# Altium project REFLOW_CONTROLLER_A01.PrjPcb
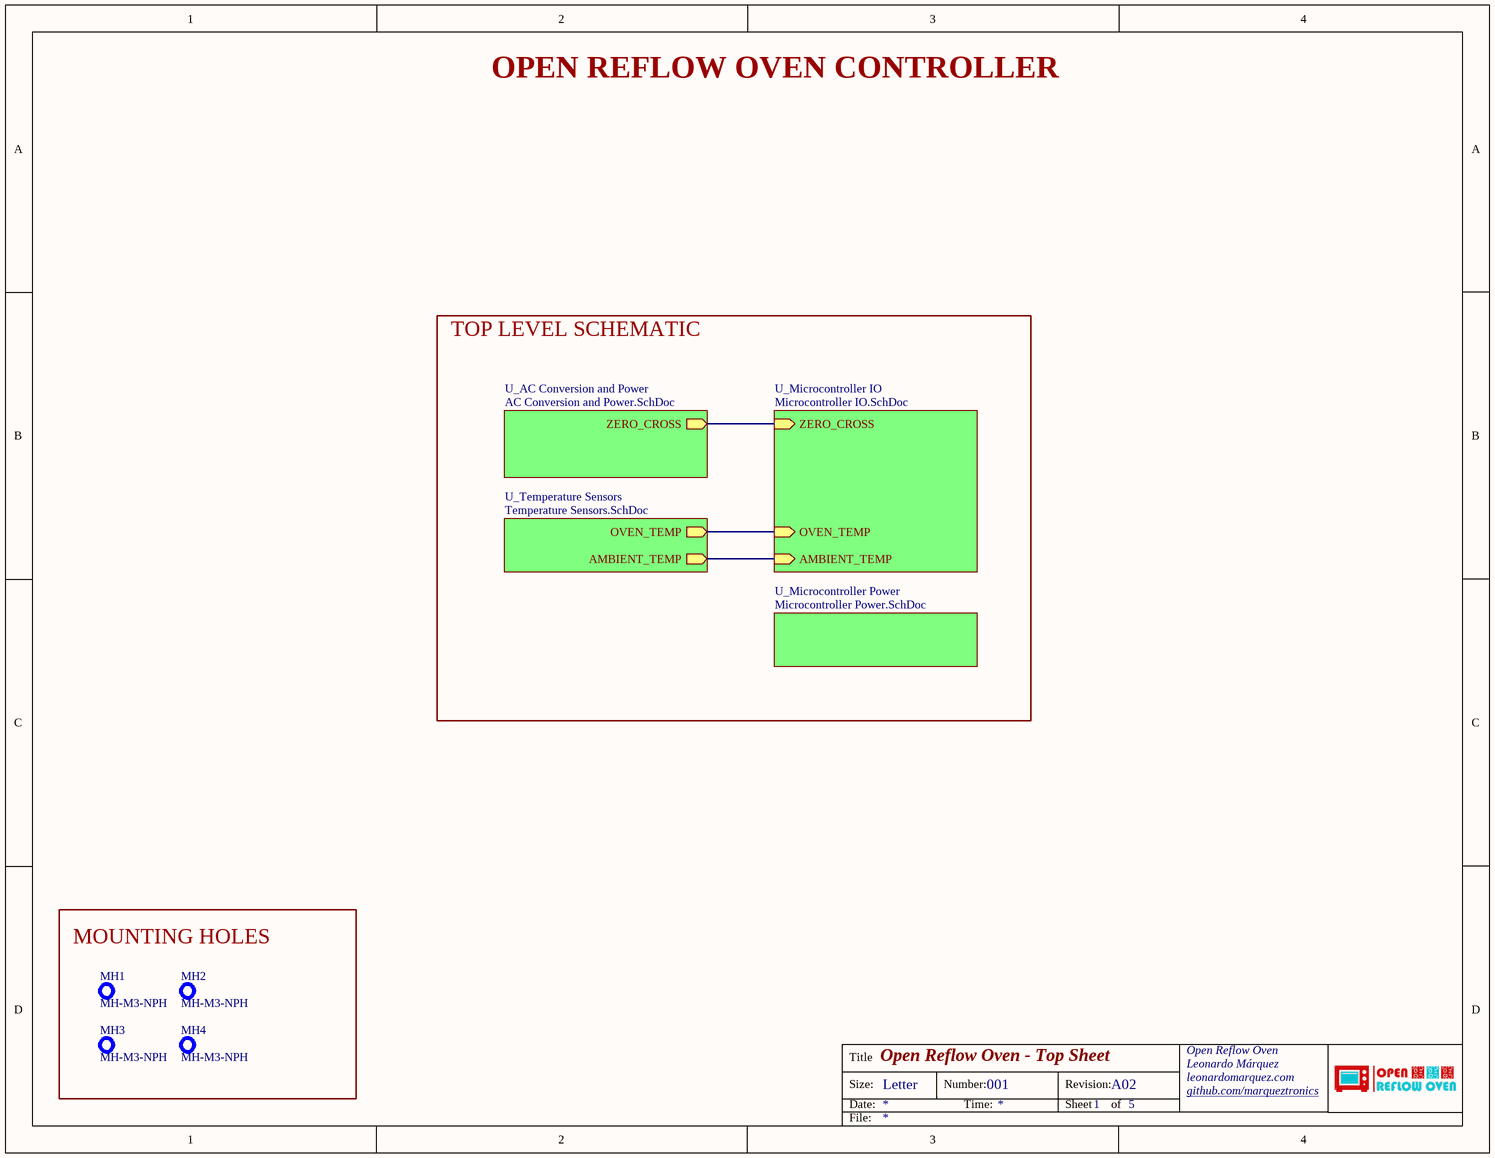
[diagram p0: Main.SchDoc]
Address1: Leonardo Márquez
5 sheets, 103 parts. Net scope: hierarchical (ports join the sheet entries above them; power ports are global).
Sheets:
  Main.SchDoc
    U_AC Conversion and Power = AC Conversion and Power.SchDoc
    U_Microcontroller IO = Microcontroller IO.SchDoc
    U_Microcontroller Power = Microcontroller Power.SchDoc
    U_Temperature Sensors = Temperature Sensors.SchDoc

## Sheet Main.SchDoc: Open Reflow Oven - Top Sheet
size Letter; DrawnBy: Leonardo Márquez; Organization: Open Reflow Oven; Address1: leonardomarquez.com; Address2: github.com/marqueztronics; DocumentNumber: 001; Revision: A02; SheetNumber: 1; SheetTotal: 5

### Parts
MH1  MH-M3-NPH  [MH-M3-NPH]  (no BOM)
MH2  MH-M3-NPH  [MH-M3-NPH]  (no BOM)
MH3  MH-M3-NPH  [MH-M3-NPH]  (no BOM)
MH4  MH-M3-NPH  [MH-M3-NPH]  (no BOM)

### Blocks framed on the sheet
MOUNTING HOLES: MH1-MH4

### Sub-sheets
U_AC Conversion and Power = AC Conversion and Power.SchDoc: ZERO_CROSS (out)
U_Microcontroller IO = Microcontroller IO.SchDoc: ZERO_CROSS (in), OVEN_TEMP (in), AMBIENT_TEMP (in)
U_Microcontroller Power = Microcontroller Power.SchDoc: no entries
U_Temperature Sensors = Temperature Sensors.SchDoc: OVEN_TEMP (out), AMBIENT_TEMP (out)

### Nets
AMBIENT_TEMP: sheet U_Microcontroller IO/AMBIENT_TEMP, sheet U_Temperature Sensors/AMBIENT_TEMP
OVEN_TEMP: sheet U_Microcontroller IO/OVEN_TEMP, sheet U_Temperature Sensors/OVEN_TEMP
ZERO_CROSS: sheet U_AC Conversion and Power/ZERO_CROSS, sheet U_Microcontroller IO/ZERO_CROSS

### Notes on the sheet
- OPEN REFLOW OVEN CONTROLLER
- TOP LEVEL SCHEMATIC
- Title
- Size:
- Date:
- Letter
- Number:
- Time:
- Revision:
- Sheet
- of
- File:

### Library data of the parts
MH1-MH4 = MH-M3-NPH: Mounting Hole M3 Non Plated Hole; Manufacturer: *; Manufacturer Part Number: *; Price Unit: *; Price 1K: *; Supplier 1: *; Supplier Part Number 1: *

## Sheet AC Conversion and Power.SchDoc: AC Conversion and Power
size Letter; DrawnBy: Leonardo Marquez; Organization: Open Reflow Oven; Address1: leonardomarquez.com; Address2: github.com/marqueztronics; DocumentNumber: 001; Revision: A02; SheetNumber: 2; SheetTotal: 5
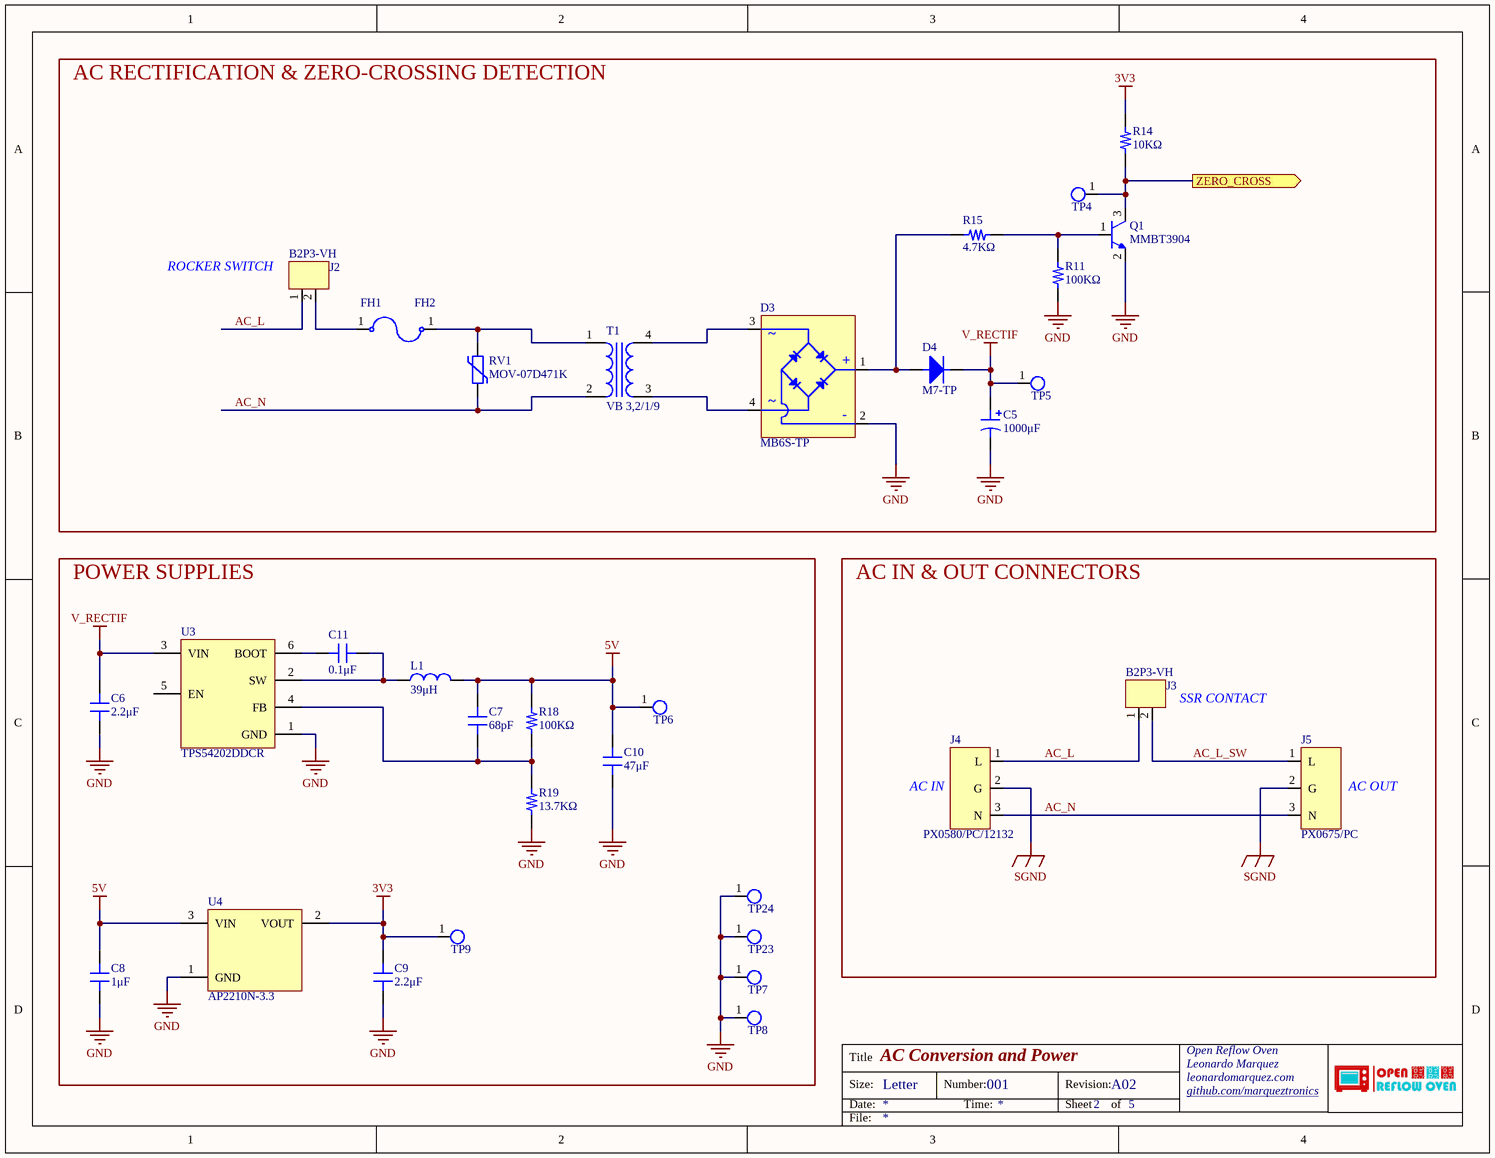
[diagram p1: AC Conversion and Power.SchDoc]

### Parts
C5  1000μF  [CPOL10X20]
C6  2.2μF  [C0805]
C7  68pF  [C0603]
C8  1μF  [C0603]
C9  2.2μF  [C0805]
C10  47μF  [C1210]
C11  0.1μF  [C0603]
D3  MB6S-TP  [MBS-1]
D4  M7-TP  [DO-214AC]
FH1  01000020Z  [100-020]  (value not drawn)
FH2  01000020Z  [100-020]  (value not drawn)
J2  B2P3-VH  [B2P3-VH]
J3  B2P3-VH  [B2P3-VH]
J4  PX0580/PC/12132  [PX0580/PC/12132]
J5  PX0675/PC  [PX0675/PC]
L1  39μH  [L_ASPI-0602S]
Q1  MMBT3904  [SOT-23]
R11  100KΩ  [R0603]
R14  10KΩ  [R0603]
R15  4.7KΩ  [R0603]
R18  100KΩ  [R0603]
R19  13.7KΩ  [R0603]
RV1  MOV-07D471K  [MOV-07D471K]
T1  VB 3,2/1/9  [VB_3,2/1/9]
TP4  TP-1MM-ROUND  [TP-1MM-ROUND]  (value not drawn)  (no BOM)
TP5  TP-1MM-ROUND  [TP-1MM-ROUND]  (value not drawn)  (no BOM)
TP6  TP-1MM-ROUND  [TP-1MM-ROUND]  (value not drawn)  (no BOM)
TP7  TP-1MM-ROUND  [TP-1MM-ROUND]  (value not drawn)  (no BOM)
TP8  TP-1MM-ROUND  [TP-1MM-ROUND]  (value not drawn)  (no BOM)
TP9  TP-1MM-ROUND  [TP-1MM-ROUND]  (value not drawn)  (no BOM)
TP23  TP-1MM-ROUND  [TP-1MM-ROUND]  (value not drawn)  (no BOM)
TP24  TP-1MM-ROUND  [TP-1MM-ROUND]  (value not drawn)  (no BOM)
U3  TPS54202DDCR  [SOT-23-6]
U4  AP2210N-3.3  [SOT-23]

### Blocks framed on the sheet
AC RECTIFICATION & ZERO-CROSSING DETECTION: C5 D3 D4 FH1 FH2 J2 Q1 R11 R14 R15 RV1 T1 TP4 TP5
POWER SUPPLIES: C6-C11 L1 R18 R19 TP6-TP9 TP23 TP24 U3 U4
AC IN & OUT CONNECTORS: J3-J5

### Ports
ZERO_CROSS (out)

### Nets
3V3: C9.2 R14.2 TP9.1 U4.2(VOUT)
5V: C7.2 C8.2 C10.2 L1.2 R18.2 TP6.1 U4.3(VIN)
GND: C5.2 C6.1 C8.1 C9.1 C10.1 D3.2(-) Q1.2(E) R11.1 R19.1 TP7.1 TP8.1 TP23.1 TP24.1 U3.1(GND) U4.1(GND)
SGND: J4.2(G) J5.2(G)
V_RECTIF: C5.1 C6.2 D4.K TP5.1 U3.3(VIN)
AC_L: J2.1 J3.1 J4.1(L)
AC_L_SW: J3.2 J5.1(L)
AC_N: J4.3(N) J5.3(N) RV1.1 T1.2
ZERO_CROSS: Q1.3(C) R14.1 TP4.1 ; port ZERO_CROSS
NetC7_1: C7.1 R18.1 R19.2 U3.4(FB)
NetC11_1: C11.1 L1.1 U3.2(SW)
NetC11_2: C11.2 U3.6(BOOT)
NetD3_1: D3.1(+) D4.A R15.1
NetD3_3: D3.3 T1.4
NetD3_4: D3.4 T1.3
NetFH1_1: FH1.1 J2.2
NetFH2_1: FH2.1 RV1.2 T1.1
NetQ1_1: Q1.1(B) R11.2 R15.2

Not connected (* = marked no-connect by the designer): U3 5(EN)

### Notes on the sheet
- (near J2) ROCKER SWITCH
- (near J3) SSR CONTACT
- (near J4) AC IN
- (near J5) AC OUT
- Title
- Size:
- Date:
- Letter
- Number:
- Time:
- Revision:
- Sheet
- of
- File:

### Library data of the parts
C5 = C-1000UF-16V-CPOL10X20: 1000uF 16V 78mΩ@100kHz ±20% 1.05A@100kHz Plugin,D10xL20mm Aluminum Electrolytic Capacitors - Leaded ROHS; Manufacturer: Rubycon; Manufacturer Part Number: 16YXF1000MEFC10X20; Price Unit: 0.1397; Price 1K: 0.0774; Supplier 1: LCSC; Supplier Part Number 1: C110138
C6 C9 = C-2.2UF-35V-X7R-C0805: 35V 2.2uF X7R ±10% 0805 Multilayer Ceramic Capacitors MLCC - SMD/SMT ROHS; Manufacturer: TDK; Manufacturer Part Number: CGA4J1X7R1V225KT0Y0E; Price Unit: 0.1161; Price 1K: 0.0724; Supplier 1: LCSC; Supplier Part Number 1: C342739
C7 = C-68PF-50V-NP0-C0603: 50V 68pF NP0 ±5% 0603 Multilayer Ceramic Capacitors MLCC - SMD/SMT ROHS; Manufacturer: Yageo; Manufacturer Part Number: CC0603JRNPO9BN680; Price Unit: 0.0027; Price 1K: 0.0021; Supplier 1: LCSC; Supplier Part Number 1: C62782
C8 = C-1UF-16V-X7R-C0603: 16V 1uF X7R ±10% 0603 Multilayer Ceramic Capacitors MLCC - SMD/SMT ROHS; Manufacturer: Samsung Electro-Mechanics; Manufacturer Part Number: CL10B105KO8NNNC; Price Unit: 0.0033; Price 1K: 0.0029; Supplier 1: LCSC; Supplier Part Number 1: C59782
C10 = C-47UF-16V-X5R-C1210: 16V 47uF X5R ±10% 1210 Multilayer Ceramic Capacitors MLCC - SMD/SMT ROHS; Manufacturer: Murata; Manufacturer Part Number: GRM32ER61C476KE15L; Price Unit: 0.1302; Price 1K: 0.079; Supplier 1: LCSC; Supplier Part Number 1: C77101
C11 = C-0.1UF-50V-X7R-C0603: 50V 100nF X7R ±10% 0603 Multilayer Ceramic Capacitors MLCC - SMD/SMT ROHS; Manufacturer: Samsung Electro-Mechanics; Manufacturer Part Number: CL10B104KB8NNNC; Price Unit: 0.0024; Price 1K: 0.0019; Supplier 1: LCSC; Supplier Part Number 1: C1591
D3 = D-BRIDGE-RECTIFIER-600V-0.5A-MBS-1: 35A 1V@400mA 800mA 600V MBS Bridge Rectifiers ROHS; Manufacturer: Micro Commercial Components; Manufacturer Part Number: MB6S-TP; Price Unit: 0.0398; Price 1K: 0.0284; Supplier 1: LCSC; Supplier Part Number 1: C85619
D4 = D-1KV-1A-DO-214AC: 1A 1kV 1.1V@1A SMA(DO-214AC) Diodes - General Purpose ROHS; Manufacturer: Micro Commercial Components; Manufacturer Part Number: M7-TP; Price Unit: 0.013; Price 1K: 0.0104; Supplier 1: LCSC; Supplier Part Number 1: C85148
FH1 FH2 = FH-1P-5X20MM-100-020: Circuit Board Mount Fuse Clips for 5mm Diameter Fuses; Manufacturer: Littelfuse; Manufacturer Part Number: 01000020Z; Price Unit: 0.206; Price 1K: 0.1324; Supplier 1: LCSC; Supplier Part Number 1: C142797
J2 J3 = J-2P-7.92MM-B2P3-VH: 1x2P 2P VH 1 7.92mm 2 Brass Plugin,P=7.92mm Wire To Board Connector ROHS; Manufacturer: JST; Manufacturer Part Number: B2P3-VH(LF)(SN); Price Unit: 0.0558; Price 1K: 0.0310; Supplier 1: LCSC; Supplier Part Number 1: C160745
J4 = J-3P-IEC-C14-PX0580/PC/12132: C14 Right Angle Panel Mount, PCB Mount IEC Connector Male, 10A, 250 V; Manufacturer: Bulgin; Manufacturer Part Number: PX0580/PC/12132; Price Unit: 5.03; Price 1K: 4.37; Supplier 1: RS; Supplier Part Number 1: 261-5840
J5 = J-3P-IEC-C14-PX0675/PC: C13 Right Angle Panel Mount, PCB Mount IEC Connector Socket, 10A, 250 V; Manufacturer: Bulgin; Manufacturer Part Number: PX0675/PC; Price Unit: 6.49; Price 1K: 5.45; Supplier 1: RS; Supplier Part Number 1: 801-948
L1 = L-39UH-860MA-L_ASPI-0602S: 860mA 39uH ±20% SMD,6.7x6.7mm Power Inductors ROHS; Manufacturer: Abracon; Manufacturer Part Number: ASPI-0602S-390M-T; Price Unit: 0.0798; Price 1K: 0.0437; Supplier 1: LCSC; Supplier Part Number 1: C187310
Q1 = Q-NPN-40V-0.2A-SOT-23: 40V 250mW 200mA NPN SOT-23 Bipolar Transistors - BJT ROHS; Manufacturer: Nexperia; Manufacturer Part Number: MMBT3904; Price Unit: 0.0155; Price 1K: 0.0124; Supplier 1: LCSC; Supplier Part Number 1: C108429
R11 R18 = R-100K-1/10W-R0603: 100mW Thick Film Resistors 75V ±100ppm/℃ ±1% 100kΩ 0603 Chip Resistor - Surface Mount ROHS; Manufacturer: Yageo; Manufacturer Part Number: RC0603FR-07100KL; Price Unit: 0.0009; Price 1K: 0.0007; Supplier 1: LCSC; Supplier Part Number 1: C14675
R14 = R-10K-1/10W-R0603: 100mW Thick Film Resistors 75V ±100ppm/℃ ±1% 10kΩ 0603 Chip Resistor - Surface Mount ROHS; Manufacturer: Yageo; Manufacturer Part Number: RC0603FR-0710KL; Price Unit: 0.0009; Price 1K: 0.0007; Supplier 1: LCSC; Supplier Part Number 1: C98220
R15 = R-4.7K-1/10W-R0603: 100mW Thick Film Resistors 75V ±100ppm/℃ ±1% 4.7kΩ 0603 Chip Resistor - Surface Mount ROHS; Manufacturer: Yageo; Manufacturer Part Number: RC0603FR-074K7L; Price Unit: 0.001; Price 1K: 0.0008; Supplier 1: LCSC; Supplier Part Number 1: C99782
R19 = R-13.7K-1/10W-R0603: 100mW Thick Film Resistors 75V ±100ppm/℃ ±1% 13.7kΩ 0603 Chip Resistor - Surface Mount ROHS; Manufacturer: Yageo; Manufacturer Part Number: RC0603FR-0713K7L; Price Unit: 0.0013; Price 1K: 0.001; Supplier 1: LCSC; Supplier Part Number 1: C482771
RV1 = RV-470V-1.2KA-MOV-07D471K: VARISTOR 470V 1.2KA DISC 7MM; Manufacturer: Bourns; Manufacturer Part Number: MOV-07D471K; Price Unit: 0.0857; Price 1K: 0.0532; Supplier 1: LCSC; Supplier Part Number 1: C1527385
T1 = T-230V-9V-VB_3,2/1/9: Block 9V ac 1 Output Through Hole PCB Transformer, 3.2VA; Manufacturer: Block; Manufacturer Part Number: VB 3,2/1/9; Price Unit: 7.24; Price 1K: 7.24; Supplier 1: RS; Supplier Part Number 1: 732-0398
TP4-TP9 TP23 TP24 = TP-1MM-ROUND: Round Test Point 1mm Dia
U3 = U-TPS54202DDCR-SOT-23-6: 4.5-V to 28-V Input, 2-A Output, EMI Friendly  Synchronous Step Down Converter; Manufacturer: Texas Instruments; Manufacturer Part Number: TPS54202DDCR; Price Unit: 0.1566; Price 1K: 0.0922; Supplier 1: LCSC; Supplier Part Number 1: C191884
U4 = U-AP2210N-3.3TRG1-SOT-23: 300mA 75dB@(100Hz) Fixed 3.3V Positive electrode 13.2V SOT-23 Linear Voltage Regulators (LDO) ROHS; Manufacturer: Diodes Incorporated; Manufacturer Part Number: AP2210N-3.3TRG1; Price Unit: 0.0907; Price 1K: 0.0597; Supplier 1: LCSC; Supplier Part Number 1: C155508

## Sheet Microcontroller IO.SchDoc: Microcontroller IO
size Letter; DrawnBy: Leonardo Marquez; Organization: Open Reflow Oven; Address1: leonardomarquez.com; Address2: github.com/marqueztronics; DocumentNumber: 001; Revision: A02; SheetNumber: 3; SheetTotal: 5
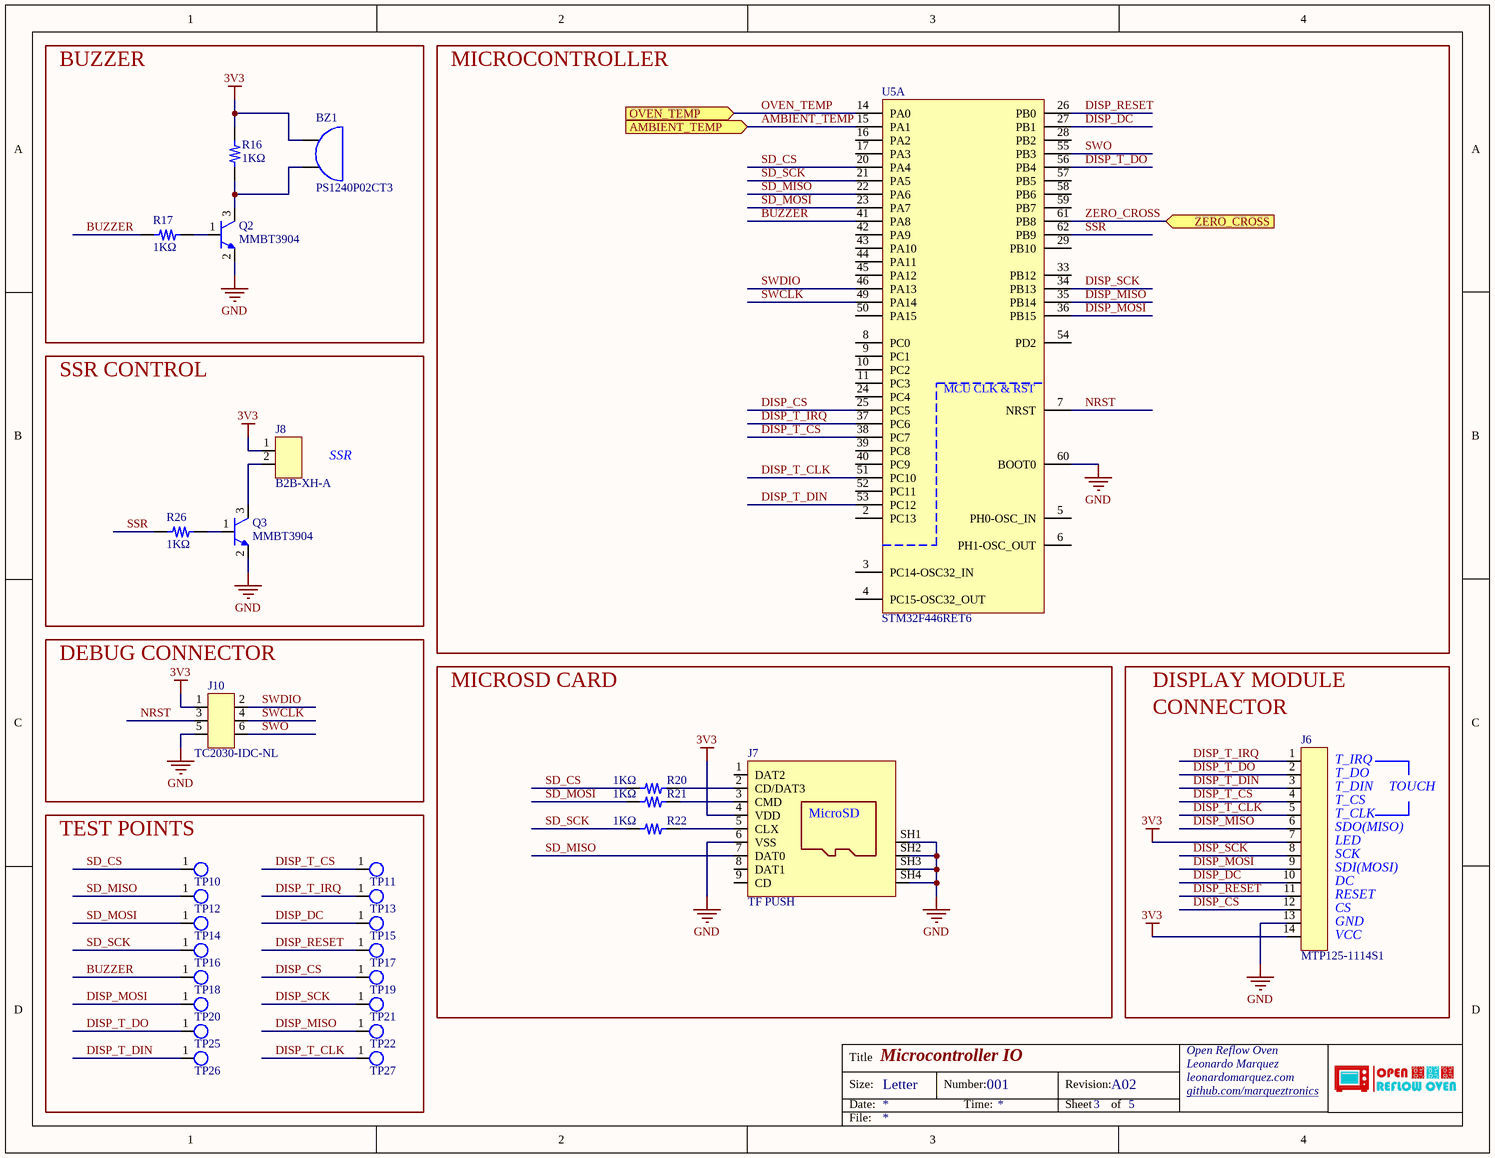
[diagram p2: Microcontroller IO.SchDoc]

### Parts
BZ1  PS1240P02CT3  [PS1240P02CT3]
J6  MTP125-1114S1  [MTP125-1114S1]
J7  TF PUSH  [TF_PUSH]
J8  B2B-XH-A  [B2B-XH-A]
J10  TC2030-IDC-NL  [TC2030-IDC-NL-FP]  (no BOM)
Q2  MMBT3904  [SOT-23]
Q3  MMBT3904  [SOT-23]
R16  1KΩ  [R0603]
R17  1KΩ  [R0603]
R20  1KΩ  [R0603]
R21  1KΩ  [R0603]
R22  1KΩ  [R0603]
R26  1KΩ  [R0603]
TP10  TP-1MM-ROUND  [TP-1MM-ROUND]  (value not drawn)  (no BOM)
TP11  TP-1MM-ROUND  [TP-1MM-ROUND]  (value not drawn)  (no BOM)
TP12  TP-1MM-ROUND  [TP-1MM-ROUND]  (value not drawn)  (no BOM)
TP13  TP-1MM-ROUND  [TP-1MM-ROUND]  (value not drawn)  (no BOM)
TP14  TP-1MM-ROUND  [TP-1MM-ROUND]  (value not drawn)  (no BOM)
TP15  TP-1MM-ROUND  [TP-1MM-ROUND]  (value not drawn)  (no BOM)
TP16  TP-1MM-ROUND  [TP-1MM-ROUND]  (value not drawn)  (no BOM)
TP17  TP-1MM-ROUND  [TP-1MM-ROUND]  (value not drawn)  (no BOM)
TP18  TP-1MM-ROUND  [TP-1MM-ROUND]  (value not drawn)  (no BOM)
TP19  TP-1MM-ROUND  [TP-1MM-ROUND]  (value not drawn)  (no BOM)
TP20  TP-1MM-ROUND  [TP-1MM-ROUND]  (value not drawn)  (no BOM)
TP21  TP-1MM-ROUND  [TP-1MM-ROUND]  (value not drawn)  (no BOM)
TP22  TP-1MM-ROUND  [TP-1MM-ROUND]  (value not drawn)  (no BOM)
TP25  TP-1MM-ROUND  [TP-1MM-ROUND]  (value not drawn)  (no BOM)
TP26  TP-1MM-ROUND  [TP-1MM-ROUND]  (value not drawn)  (no BOM)
TP27  TP-1MM-ROUND  [TP-1MM-ROUND]  (value not drawn)  (no BOM)
U5  STM32F446RET6  [LQFP-64_10X10]  (part A of 2)

### Blocks framed on the sheet
BUZZER: BZ1 Q2 R16 R17
MICROCONTROLLER: U5
SSR CONTROL: J8 Q3 R26
DEBUG CONNECTOR: J10
MICROSD CARD: J7 R20-R22
TEST POINTS: TP10-TP22 TP25-TP27

### Ports
AMBIENT_TEMP (in), OVEN_TEMP (in), ZERO_CROSS (in)

### Nets
3V3: BZ1.1 J6.7 J6.14 J7.4(VDD) J8.1 J10.1 R16.2
GND: J6.13 J7.6(VSS) J7.SH1(SHIELD) J7.SH2(SHIELD) J7.SH3(SHIELD) J7.SH4(SHIELD) J10.5 Q2.2(E) Q3.2(E) U5.60(BOOT0)
AMBIENT_TEMP: U5.15(PA1) ; port AMBIENT_TEMP
BUZZER: R17.2 TP18.1 U5.41(PA8)
DISP_CS: J6.12 TP19.1 U5.25(PC5)
DISP_DC: J6.10 TP15.1 U5.27(PB1)
DISP_MISO: J6.6 TP22.1 U5.35(PB14)
DISP_MOSI: J6.9 TP20.1 U5.36(PB15)
DISP_RESET: J6.11 TP17.1 U5.26(PB0)
DISP_SCK: J6.8 TP21.1 U5.34(PB13)
DISP_T_CLK: J6.5 TP27.1 U5.51(PC10)
DISP_T_CS: J6.4 TP11.1 U5.38(PC7)
DISP_T_DIN: J6.3 TP26.1 U5.53(PC12)
DISP_T_DO: J6.2 TP25.1 U5.56(PB4)
DISP_T_IRQ: J6.1 TP13.1 U5.37(PC6)
NRST: J10.3 U5.7(NRST)
OVEN_TEMP: U5.14(PA0) ; port OVEN_TEMP
SD_CS: R20.2 TP10.1 U5.20(PA4)
SD_MISO: J7.7(DAT0) TP12.1 U5.22(PA6)
SD_MOSI: R21.2 TP14.1 U5.23(PA7)
SD_SCK: R22.2 TP16.1 U5.21(PA5)
SSR: R26.2 U5.62(PB9)
SWCLK: J10.4 U5.49(PA14)
SWDIO: J10.2 U5.46(PA13)
SWO: J10.6 U5.55(PB3)
ZERO_CROSS: U5.61(PB8) ; port ZERO_CROSS
NetBZ1_2: BZ1.2 Q2.3(C) R16.1
NetJ7_2: J7.2(CD/DAT3) R20.1
NetJ7_3: J7.3(CMD) R21.1
NetJ7_5: J7.5(CLX) R22.1
NetJ8_2: J8.2 Q3.3(C)
NetQ2_1: Q2.1(B) R17.1
NetQ3_1: Q3.1(B) R26.1

Not connected (* = marked no-connect by the designer): J7 1(DAT2) 8(DAT1) 9(CD); U5 2(PC13) 3(PC14-OSC32_IN) 4(PC15-OSC32_OUT) 5(PH0-OSC_IN) 6(PH1-OSC_OUT) 8(PC0) 9(PC1) 10(PC2) 11(PC3) 16(PA2) 17(PA3) 24(PC4) 28(PB2) 29(PB10) 33(PB12) 39(PC8) 40(PC9) 42(PA9) 43(PA10) 44(PA11) 45(PA12) 50(PA15) 52(PC11) 54(PD2) 57(PB5) 58(PB6) 59(PB7)

### Notes on the sheet
- (near J8) SSR
- DISPLAY MODULE
- CONNECTOR
- (near J6) T_IRQ
- (near J6) T_DO
- (near J6) T_DIN
- (near J6) T_CS
- (near J6) T_CLK
- (near J6) SDO(MISO)
- TOUCH
- (near J6) LED
- (near J6) SCK
- (near J6) SDI(MOSI)
- (near J6) DC
- (near J6) RESET
- (near J6) CS
- (near J6) GND
- (near J6) VCC
- Title
- Size:
- Date:
- Letter
- Number:
- Time:
- Revision:
- Sheet
- of
- File:
- (in symbol J-MICROSD-TF_PUSH) MicroSD
- (in symbol U-STM32F446RET6-LQFP-64_10X10, part A) MCU CLK & RST

### Library data of the parts
BZ1 = BZ-4KHZ-30V-PS1240P02CT3: 60dB Externally Driven Externally Driven 4kHz Plugin,D=12.2mm Buzzers ROHS; Manufacturer: TDK; Manufacturer Part Number: PS1240P02CT3; Price Unit: 0.2373; Price 1K: 0.1495; Supplier 1: LCSC; Supplier Part Number 1: C76873
J6 = J-14P-HDR-MALE-2.54MM-MTP125-1114S1: 14P 2.54mm Single Row 1x14P Plugin,P=2.54mm Pin Headers ROHS; Manufacturer: MINTRON; Manufacturer Part Number: MTP125-1114S1; Price Unit: 0.0696; Price 1K: 0.0435; Supplier 1: LCSC; Supplier Part Number 1: C5142340
J7 = J-MICROSD-TF_PUSH: -20℃~+90℃ 2mm Card Slot MicroSD card (TF card) Self-bouncing SMD SD Card / Memory Card Connector ROHS; Manufacturer: SHOU HAN; Manufacturer Part Number: TF PUSH; Price Unit: 0.0465; Price 1K: 0.03; Supplier 1: LCSC; Supplier Part Number 1: C393941
J8 = J-2P-2.5MM-B2B-XH-A: 1x2P 2P XH 1 2.5mm 2 Brass Plugin,P=2.5mm Wire To Board Connector ROHS; Manufacturer: JST; Manufacturer Part Number: B2B-XH-A(LF)(SN); Price Unit: 0.0301; Price 1K: 0.0208; Supplier 1: LCSC; Supplier Part Number 1: C158012
J10 = J-6P-TAG-CONNECT-TC2030-IDC-NL-FP: “No Legs” 6-pin Plug-of-Nails™ Cable fitted with a 6-pin 0.1″ pitch ribbon connector; Manufacturer: Tag-Connect; Supplier 1: Tag-Connect; Supplier Part Number 1: TC2030-IDC-NL; Manufacturer Part Number: TC2030-IDC-NL; Price Unit: 0.00; Price 1K: 0.00
Q2 Q3 = Q-NPN-40V-0.2A-SOT-23: as Q1 on sheet AC Conversion and Power; Manufacturer Part Number: MMBT3904; Price Unit: 0.0155; Price 1K: 0.0124; Supplier 1: LCSC; Supplier Part Number 1: C108429
R16 R17 R20-R22 R26 = R-1K-1/10W-R0603: 100mW Thick Film Resistors 75V ±100ppm/℃ ±1% 1kΩ 0603 Chip Resistor - Surface Mount ROHS; Manufacturer: Yageo; Manufacturer Part Number: RC0603FR-071KL; Price Unit: 0.001; Price 1K: 0.0008; Supplier 1: LCSC; Supplier Part Number 1: C22548
TP10-TP22 TP25-TP27 = TP-1MM-ROUND: Round Test Point 1mm Dia
U5 = U-STM32F446RET6-LQFP-64_10X10: 512KB 1.7V~3.6V ARM-M4 128KB 180MHz FLASH 50 LQFP-64(10x10) Microcontrollers (MCU/MPU/SOC) ROHS; Manufacturer: STMicroelectronics; Manufacturer Part Number: STM32F446RET6; Price Unit: 3.3018; Price 1K: 2.3276; Supplier 1: LCSC; Supplier Part Number 1: C69336

## Sheet Microcontroller Power.SchDoc: Microcontroller Power
size Letter; DrawnBy: Leonardo Marquez; Engineer: 4; Organization: Open Reflow Oven; Address1: leonardomarquez.com; Address2: github.com/marqueztronics; DocumentNumber: 001; Revision: A02; SheetNumber: 4; SheetTotal: 5
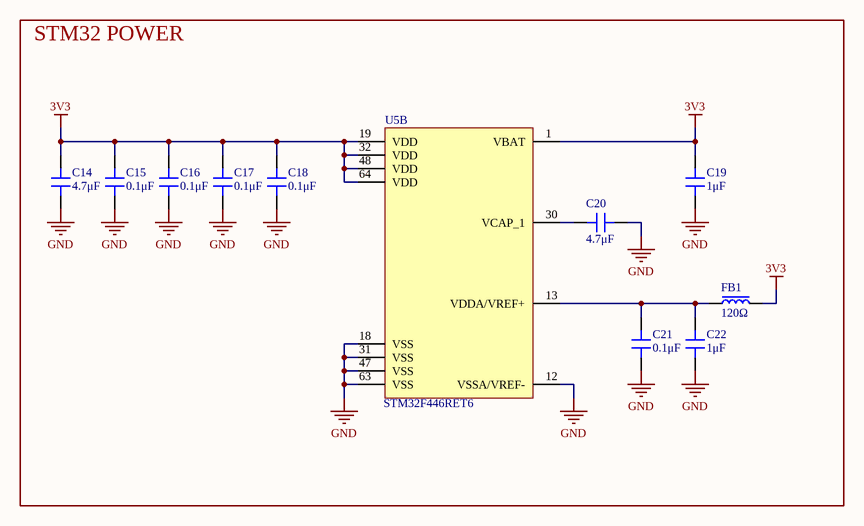
[diagram p3: Microcontroller Power.SchDoc]

### Parts
C14  4.7μF  [C0805]
C15  0.1μF  [C0603]
C16  0.1μF  [C0603]
C17  0.1μF  [C0603]
C18  0.1μF  [C0603]
C19  1μF  [C0603]
C20  4.7μF  [C0805]
C21  0.1μF  [C0603]
C22  1μF  [C0603]
FB1  120Ω  [FB0603]
U5  STM32F446RET6  [LQFP-64_10X10]  (part B of 2)

### Blocks framed on the sheet
STM32 POWER: C14-C22 FB1 U5

### Nets
3V3: C14.2 C15.2 C16.2 C17.2 C18.2 C19.2 FB1.2 U5.1(VBAT) U5.19(VDD) U5.32(VDD) U5.48(VDD) U5.64(VDD)
GND: C14.1 C15.1 C16.1 C17.1 C18.1 C19.1 C20.1 C21.1 C22.1 U5.12(VSSA/VREF-) U5.18(VSS) U5.31(VSS) U5.47(VSS) U5.63(VSS)
NetC20_2: C20.2 U5.30(VCAP_1)
NetC21_2: C21.2 C22.2 FB1.1 U5.13(VDDA/VREF+)

### Notes on the sheet
- Title
- Size:
- Date:
- Letter
- Number:
- Time:
- Revision:
- Sheet
- of
- File:

### Library data of the parts
C14 C20 = C-4.7UF-16V-X7R-C0805: 16V 4.7uF X7R ±10% 0805 Multilayer Ceramic Capacitors MLCC - SMD/SMT ROHS; Manufacturer: Taiyo Yuden; Manufacturer Part Number: EMK212B7475KG-T; Price Unit: 0.0182; Price 1K: 0.0145; Supplier 1: LCSC; Supplier Part Number 1: C92762
C15-C18 C21 = C-0.1UF-50V-X7R-C0603: as C11 on sheet AC Conversion and Power; Price Unit: 0.0024; Price 1K: 0.0019; Supplier 1: LCSC; Supplier Part Number 1: C1591
C19 C22 = C-1UF-16V-X7R-C0603: as C8 on sheet AC Conversion and Power; Price Unit: 0.0033; Price 1K: 0.0029; Supplier 1: LCSC; Supplier Part Number 1: C59782
FB1 = FB-120OHM-50MOHM-FB0603: 50mΩ ±25% 120Ω@100MHz 0603 Ferrite Beads ROHS; Manufacturer: Murata Electronics; Manufacturer Part Number: BLM18PG121SN1D; Price Unit: 0.0062; Price 1K: 0.0049; Supplier 1: LCSC; Supplier Part Number 1: C14709
U5 = U-STM32F446RET6-LQFP-64_10X10: 35A 1V@400mA 800mA 600V MBS Bridge Rectifiers ROHS; Manufacturer: STMicroelectronics; Manufacturer Part Number: STM32F446RET6; Price Unit: 3.3018; Price 1K: 2.3276; Supplier 1: LCSC; Supplier Part Number 1: C69336

## Sheet Temperature Sensors.SchDoc: Temperature Sensors
size Letter; Author: Leonardo Marquez; DrawnBy: Leonardo Marquez; Organization: Open Reflow Oven; Address1: leonardomarquez.com; Address2: github.com/marqueztronics; DocumentNumber: 001; Revision: A02; SheetNumber: 5; SheetTotal: 5
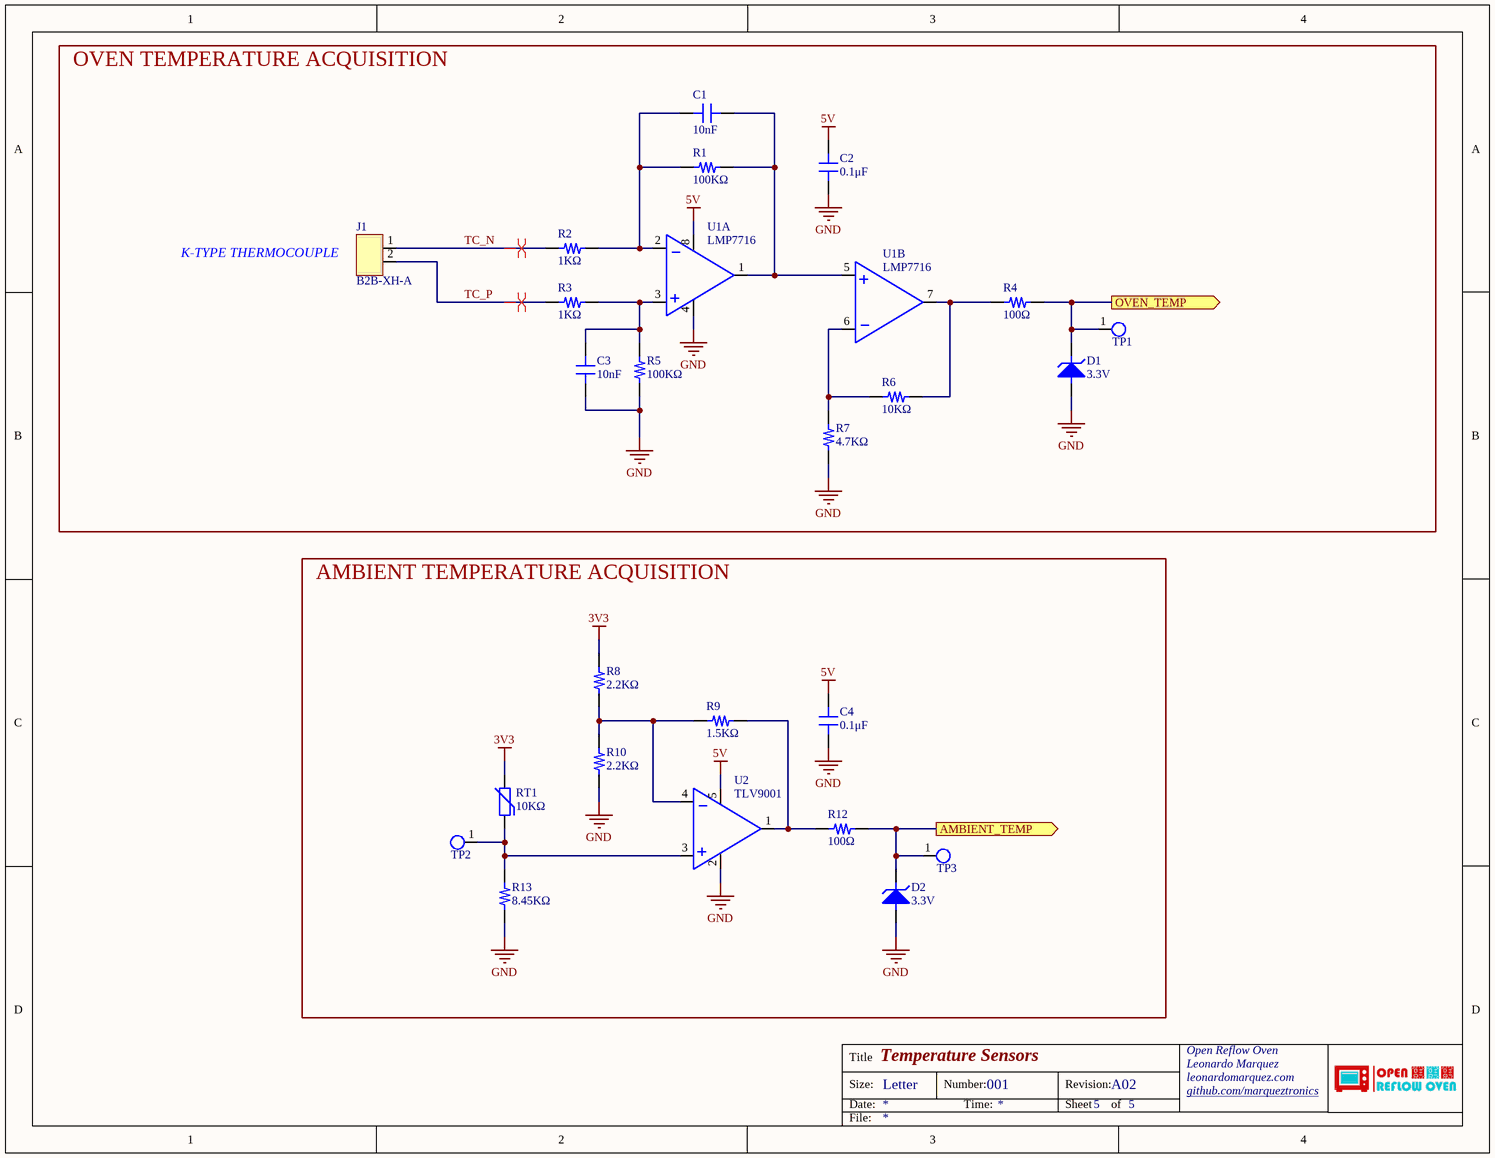
[diagram p4: Temperature Sensors.SchDoc]

### Parts
C1  10nF  [C0603]
C2  0.1μF  [C0603]
C3  10nF  [C0603]
C4  0.1μF  [C0603]
D1  3.3V  [SOD-323]
D2  3.3V  [SOD-323]
J1  B2B-XH-A  [B2B-XH-A]
R1  100KΩ  [R0603]
R2  1KΩ  [R0603]
R3  1KΩ  [R0603]
R4  100Ω  [R0603]
R5  100KΩ  [R0603]
R6  10KΩ  [R0603]
R7  4.7KΩ  [R0603]
R8  2.2KΩ  [R0603]
R9  1.5KΩ  [R0603]
R10  2.2KΩ  [R0603]
R12  100Ω  [R0603]
R13  8.45KΩ  [R0603]
RT1  10KΩ  [RT0603]
TP1  TP-1MM-ROUND  [TP-1MM-ROUND]  (value not drawn)  (no BOM)
TP2  TP-1MM-ROUND  [TP-1MM-ROUND]  (value not drawn)  (no BOM)
TP3  TP-1MM-ROUND  [TP-1MM-ROUND]  (value not drawn)  (no BOM)
U1  LMP7716  [VSSOP-8]  (parts A,B of 2)
U2  TLV9001  [SOT-23-5]

### Blocks framed on the sheet
OVEN TEMPERATURE ACQUISITION: C1-C3 D1 J1 R1-R7 TP1 U1
AMBIENT TEMPERATURE ACQUISITION: C4 D2 R8-R10 R12 R13 RT1 TP2 TP3 U2

### Ports
AMBIENT_TEMP (out), OVEN_TEMP (out)

### Nets
3V3: R8.2 RT1.2
5V: C2.2 C4.2 U1.8(V+) U2.5(V+)
GND: C2.1 C3.1 C4.1 D1.A D2.A R5.1 R7.1 R10.1 R13.1 U1.4(V-) U2.2(V-)
AMBIENT_TEMP: D2.K R12.2 TP3.1 ; port AMBIENT_TEMP
OVEN_TEMP: D1.K R4.2 TP1.1 ; port OVEN_TEMP
TC_N: J1.1 R2.1
TC_P: J1.2 R3.1
NetC1_1: C1.1 R1.2 R2.2 U1.2(-IN_A)
NetC1_2: C1.2 R1.1 U1.1(OUT_A) U1.5(+IN_B)
NetC3_2: C3.2 R3.2 R5.2 U1.3(+IN_A)
NetR4_1: R4.1 R6.2 U1.7(OUT_B)
NetR6_1: R6.1 R7.2 U1.6(-IN_B)
NetR8_1: R8.1 R9.1 R10.2 U2.4(IN-)
NetR9_2: R9.2 R12.1 U2.1(OUT)
NetR13_2: R13.2 RT1.1 TP2.1 U2.3(IN+)

### Layout directives
differential pair: TC_N, TC_P

### Notes on the sheet
- K-TYPE THERMOCOUPLE
- Title
- Size:
- Date:
- Letter
- Number:
- Time:
- Revision:
- Sheet
- of
- File:

### Library data of the parts
C1 C3 = C-10NF-50V-X7R-C0603: 50V 10nF X7R ±10% 0603 Multilayer Ceramic Capacitors MLCC - SMD/SMT ROHS; Manufacturer: Samsung Electro-Mechanics; Manufacturer Part Number: CL10B103KB8NNNC; Price Unit: 0.0028; Price 1K: 0.0022; Supplier 1: LCSC; Supplier Part Number 1: C1589
C2 C4 = C-0.1UF-50V-X7R-C0603: as C11 on sheet AC Conversion and Power; Price Unit: 0.0024; Price 1K: 0.0019; Supplier 1: LCSC; Supplier Part Number 1: C1591
D1 D2 = D-ZENER-3.3V-SOD-323: Single 3.32V~3.53V 400mW 3.3V SOD-323 Zener Diodes ROHS; Manufacturer: Nexperia; Manufacturer Part Number: PDZ3.3B,115; Price Unit: 0.0192; Price 1K: 0.013; Supplier 1: LCSC; Supplier Part Number 1: C426855
J1 = J-2P-2.5MM-B2B-XH-A: as J8 on sheet Microcontroller IO; Price Unit: 0.0301; Price 1K: 0.0208; Supplier 1: LCSC; Supplier Part Number 1: C158012
R1 R5 = R-100K-1/10W-R0603: as R11 on sheet AC Conversion and Power; Price Unit: 0.0009; Price 1K: 0.0007; Supplier 1: LCSC; Supplier Part Number 1: C14675
R2 R3 = R-1K-1/10W-R0603: as R16 on sheet Microcontroller IO; Price Unit: 0.001; Price 1K: 0.0008; Supplier 1: LCSC; Supplier Part Number 1: C22548
R4 R12 = R-100-1/10W-R0603: 100mW Thick Film Resistors 75V ±100ppm/℃ ±1% 100Ω 0603 Chip Resistor - Surface Mount ROHS; Manufacturer: Yageo; Manufacturer Part Number: RC0603FR-07100RL; Price Unit: 0.001; Price 1K: 0.0007; Supplier 1: LCSC; Supplier Part Number 1: C105588
R6 = R-10K-1/10W-R0603: as R14 on sheet AC Conversion and Power; Price Unit: 0.0009; Price 1K: 0.0007; Supplier 1: LCSC; Supplier Part Number 1: C98220
R7 = R-4.7K-1/10W-R0603: as R15 on sheet AC Conversion and Power; Price Unit: 0.001; Price 1K: 0.0008; Supplier 1: LCSC; Supplier Part Number 1: C99782
R8 R10 = R-2.2K-1/10W-R0603: 100mW Thick Film Resistors 75V ±100ppm/℃ ±1% 2.2kΩ 0603 Chip Resistor - Surface Mount ROHS; Manufacturer: Yageo; Manufacturer Part Number: RC0603FR-072K2L; Price Unit: 0.0011; Price 1K: 0.0009; Supplier 1: LCSC; Supplier Part Number 1: C114662
R9 = R-1.5K-1/10W-R0603: 100mW Thick Film Resistors 75V ±100ppm/℃ ±1% 1.5kΩ 0603 Chip Resistor - Surface Mount ROHS; Manufacturer: Yageo; Manufacturer Part Number: RC0603FR-071K5L; Price Unit: 0.0012; Price 1K: 0.0009; Supplier 1: LCSC; Supplier Part Number 1: C114668
R13 = R-8.45K-1/10W-R0603: 100mW Thick Film Resistors 75V ±100ppm/℃ ±1% 8.45kΩ 0603 Chip Resistor - Surface Mount ROHS; Manufacturer: Yageo; Manufacturer Part Number: RC0603FR-078K45L; Price Unit: 0.0012; Price 1K: 0.001; Supplier 1: LCSC; Supplier Part Number 1: C163417
RT1 = RT-10K-NTC-RT0603: 10kΩ 330uA 100mW ±1% 3950K ±1% 0603 NTC Thermistors ROHS; Manufacturer: Sunlord; Manufacturer Part Number: SDNT1608X103F3950FTF; Price Unit: 0.0206; Price 1K: 0.0148; Supplier 1: LCSC; Supplier Part Number 1: C279936
TP1-TP3 = TP-1MM-ROUND: Round Test Point 1mm Dia
U1 = U-LMP7716MM/NOPB-VSSOP-8: 17MHz 0.1pA Dual VSSOP-8 Precision OpAmps ROHS; Manufacturer: Texas Instruments; Manufacturer Part Number: LMP7716MM/NOPB; Price Unit: 2.1951; Price 1K: 1.3767; Supplier 1: LCSC; Supplier Part Number 1: C72531
U2 = U-TLV9001IDBVR-SOT-23-5: 5pA Single 1MHz SOT-23-5 Operational Amplifier ROHS; Manufacturer: Texas Instruments; Manufacturer Part Number: TLV9001IDBVR; Price Unit: 0.2141; Price 1K: 0.136; Supplier 1: LCSC; Supplier Part Number 1: C398363

## Nets that join several sheets
3V3: AC Conversion and Power (C9.2 R14.2 TP9.1 U4.2), Microcontroller IO (7 pins), Microcontroller Power (12 pins), Temperature Sensors (R8.2 RT1.2)
5V: AC Conversion and Power (7 pins), Temperature Sensors (C2.2 C4.2 U1.8 U2.5)
GND: AC Conversion and Power (15 pins), Microcontroller IO (10 pins), Microcontroller Power (14 pins), Temperature Sensors (11 pins)
AMBIENT_TEMP: Microcontroller IO (U5.15), Temperature Sensors (D2.K R12.2 TP3.1)
OVEN_TEMP: Microcontroller IO (U5.14), Temperature Sensors (D1.K R4.2 TP1.1)
ZERO_CROSS: AC Conversion and Power (Q1.3 R14.1 TP4.1), Microcontroller IO (U5.61)